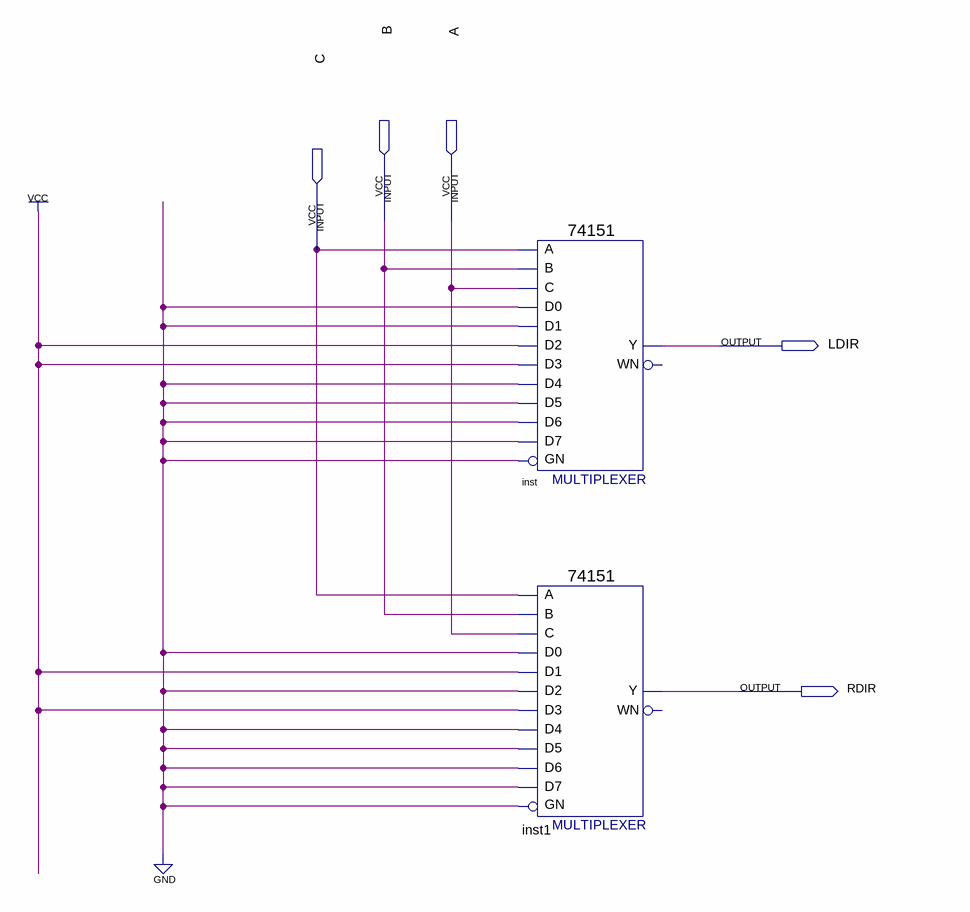
[diagram p0: schematic sheet]
// Quartus schematic digibotController.bdf as structural Verilog: 2 symbols, 5 pins
module digibotController (
  input  B,
  input  A,
  input  C,
  output LDIR,
  output RDIR
);

  \74151  inst (
    .GN(1'b0), .C(A), .B(B), .A(C), .D5(1'b0), .D0(1'b0), .D1(1'b0), .D4(1'b0), .D3(1'b1), .D2(1'b1),
    .D6(1'b0), .D7(1'b0), .Y(LDIR));  // open: WN
  \74151  inst1 (
    .GN(1'b0), .C(A), .B(B), .A(C), .D5(1'b0), .D0(1'b0), .D1(1'b1), .D4(1'b0), .D3(1'b1), .D2(1'b0),
    .D6(1'b0), .D7(1'b0), .Y(RDIR));  // open: WN
endmodule
